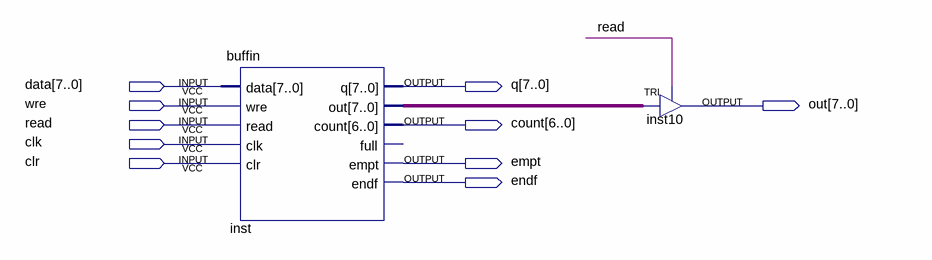
[diagram p0: schematic sheet]
// Quartus schematic test.bdf as structural Verilog: 2 symbols, 10 pins
module test (
  input  [7:0] data,
  input  wre,
  input  read,
  input  clk,
  input  clr,
  output [7:0] q,
  output [7:0] out,
  output [6:0] count,
  output empt,
  output endf
);

  wire [7:0] inst_out;

  buffin inst (
    .data(data), .wre(wre), .read(read), .clk(clk), .clr(clr), .q(q), .out(inst_out), .count(count),
    .empt(empt), .endf(endf));  // open: full
  TRI inst10[7:0] (.IN(inst_out), .OE(read), .OUT(out));
endmodule
